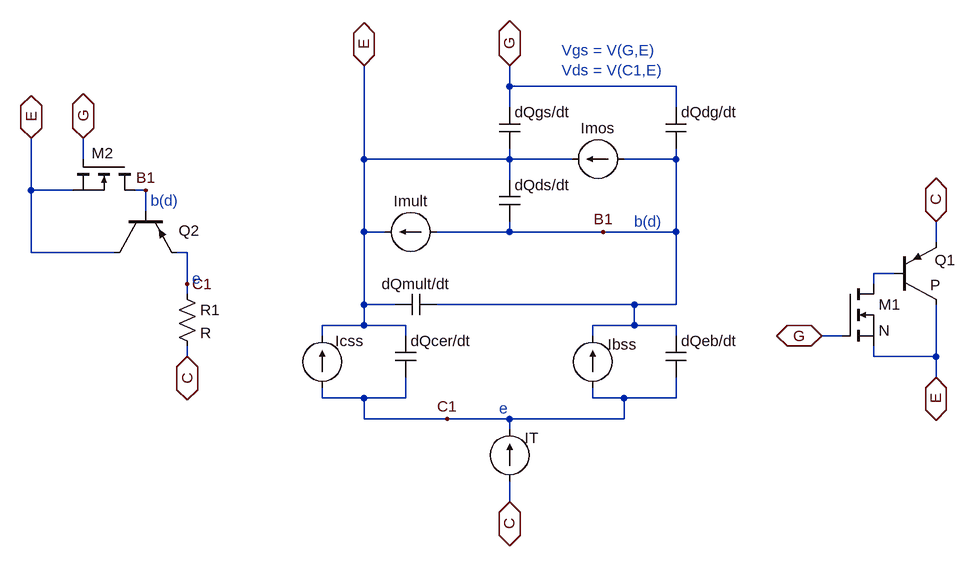
[diagram p0: schematic builtin_06_IGBT.asc]
builtin_06_IGBT.asc, the LTspice schematic file:
Version 4
SHEET 1 1024 944
WIRE 160 176 160 144
WIRE 416 176 160 176
WIRE 160 208 160 176
WIRE 416 208 416 176
WIRE -496 288 -496 256
WIRE -64 288 -64 144
WIRE 160 288 160 272
WIRE 160 288 -64 288
WIRE 256 288 160 288
WIRE 416 288 416 272
WIRE 416 288 336 288
WIRE 160 320 160 288
WIRE -576 336 -576 256
WIRE -512 336 -576 336
WIRE -400 336 -416 336
WIRE -400 368 -400 336
WIRE -64 400 -64 288
WIRE -32 400 -64 400
WIRE 160 400 160 384
WIRE 160 400 48 400
WIRE 304 400 160 400
WIRE 416 400 416 288
WIRE 416 400 304 400
WIRE 816 416 816 384
WIRE -576 432 -576 336
WIRE -448 432 -576 432
WIRE -336 432 -352 432
WIRE 752 464 720 464
WIRE -336 480 -336 432
WIRE 720 480 720 464
WIRE -336 496 -336 480
WIRE -64 512 -64 400
WIRE -16 512 -64 512
WIRE 352 512 48 512
WIRE 416 512 416 400
WIRE 416 512 352 512
WIRE -64 544 -64 512
WIRE -64 544 -128 544
WIRE 0 544 -64 544
WIRE 352 544 352 512
WIRE 352 544 288 544
WIRE 416 544 352 544
WIRE -128 560 -128 544
WIRE 0 560 0 544
WIRE 288 560 288 544
WIRE 416 560 416 544
WIRE 672 560 640 560
WIRE -336 592 -336 576
WIRE 720 592 720 576
WIRE 816 592 816 512
WIRE 816 592 720 592
WIRE 816 624 816 592
WIRE -128 656 -128 640
WIRE -64 656 -128 656
WIRE 0 656 0 624
WIRE 0 656 -64 656
WIRE 288 656 288 640
WIRE 336 656 288 656
WIRE 416 656 416 624
WIRE 416 656 336 656
WIRE -64 688 -64 656
WIRE 64 688 -64 688
WIRE 160 688 64 688
WIRE 336 688 336 656
WIRE 336 688 160 688
WIRE 160 704 160 688
WIRE 160 816 160 784
FLAG -64 144 E
IOPIN -64 144 BiDir
FLAG 160 144 G
IOPIN 160 144 BiDir
FLAG 160 816 C
IOPIN 160 816 BiDir
FLAG 64 688 C1
FLAG 304 400 B1
FLAG 816 384 C
IOPIN 816 384 BiDir
FLAG 640 560 G
IOPIN 640 560 BiDir
FLAG 816 624 E
IOPIN 816 624 BiDir
FLAG -336 592 C
IOPIN -336 592 BiDir
FLAG -496 256 G
IOPIN -496 256 BiDir
FLAG -576 256 E
IOPIN -576 256 BiDir
FLAG -400 336 B1
FLAG -336 480 C1
SYMBOL cap 400 208 R0
SYMATTR InstName dQdg/dt
SYMATTR Value ""
SYMBOL cap 144 208 R0
SYMATTR InstName dQgs/dt
SYMATTR Value ""
SYMBOL cap 144 320 R0
SYMATTR InstName dQds/dt
SYMATTR Value ""
SYMBOL current 336 288 R90
WINDOW 0 -32 40 VBottom 0
WINDOW 3 32 40 VTop 0
SYMATTR InstName Imos
SYMATTR Value ""
SYMBOL current 48 400 R90
WINDOW 0 -32 40 VBottom 0
WINDOW 3 32 40 VTop 0
SYMATTR InstName Imult
SYMATTR Value ""
SYMBOL cap 48 496 R90
WINDOW 0 0 32 VBottom 0
WINDOW 3 32 32 VTop 0
SYMATTR InstName dQmult/dt
SYMATTR Value ""
SYMBOL cap 400 560 R0
SYMATTR InstName dQeb/dt
SYMATTR Value ""
SYMBOL current 288 640 R180
WINDOW 0 -23 67 Right 0
WINDOW 3 24 -21 Left 0
SYMATTR InstName Ibss
SYMATTR Value ""
SYMBOL cap -16 560 R0
SYMATTR InstName dQcer/dt
SYMATTR Value ""
SYMBOL current -128 640 R180
WINDOW 0 -20 72 Right 0
WINDOW 3 24 -21 Left 0
SYMATTR InstName Icss
SYMATTR Value ""
SYMBOL current 160 784 R180
WINDOW 0 -23 67 Right 0
WINDOW 3 24 -21 Left 0
SYMATTR InstName IT
SYMATTR Value ""
SYMBOL nmos 672 480 R0
SYMATTR InstName M1
SYMATTR Value N
SYMBOL pnp 752 512 M180
WINDOW 0 62 69 Left 0
WINDOW 3 55 30 Left 0
SYMATTR InstName Q1
SYMATTR Value P
SYMBOL nmos -416 288 R90
WINDOW 0 -9 67 VLeft 0
WINDOW 3 57 26 VRight 0
SYMATTR InstName M2
SYMATTR Value ""
SYMBOL pnp -448 368 M90
WINDOW 0 30 99 VRight 0
WINDOW 3 47 55 VLeft 0
SYMATTR InstName Q2
SYMATTR Value ""
SYMBOL res -352 480 R0
SYMATTR InstName R1
TEXT 352 384 Left 0 ;b(d)
TEXT 144 672 Left 0 ;e
TEXT -392 352 Left 0 ;b(d)
TEXT -328 472 Left 0 ;e
TEXT 240 120 Left 0 ;Vgs = V(G,E)\nVds = V(C1,E)

The netlist it stands for:
* builtin_06_IGBT.asc
C§dQdg/dt G B1
C§dQgs/dt G E
C§dQds/dt E B1
Imos B1 E
Imult B1 E
C§dQmult/dt B1 E
C§dQeb/dt B1 C1
Ibss C1 B1
C§dQcer/dt E C1
Icss C1 E
IT C C1
M1 N001 G E E N
Q1 E N001 C 0 P
M2 B1 G E E
Q2 E B1 C1 0
R1 C1 C R
.model NPN NPN
.model PNP PNP
.lib standard.bjt
.model NMOS NMOS
.model PMOS PMOS
.lib standard.mos
* b(d)
* e
* b(d)
* e
* Vgs = V(G,E)
* Vds = V(C1,E)
.backanno
.end